# Altium schematic sheet SensorBoard.SchDoc
size A4
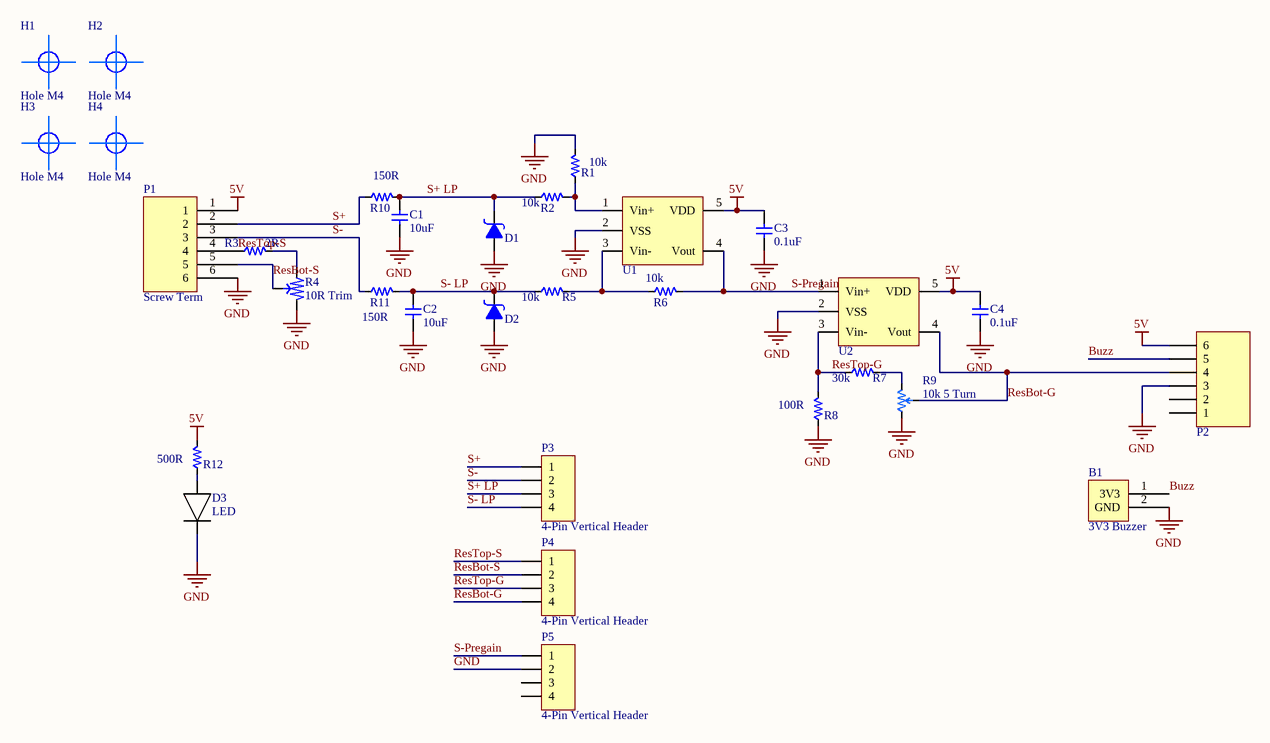
[diagram p0: SensorBoard.SchDoc]

## Parts
B1  3V3 Buzzer  [Buzzer_surfacemount]
C1  value 10uF  [PCB_GENERIC_SMD_0603]  (hidden comment: C060-0001U-00)
C2  value 10uF  [PCB_GENERIC_SMD_0603]  (hidden comment: C060-0001U-00)
C3  value 0.1uF  [PCB_GENERIC_SMD_0603]  (hidden comment: C060-0001U-00)
C4  value 0.1uF  [PCB_GENERIC_SMD_0603]  (hidden comment: C060-0001U-00)
D1  ONSEMI_MBRM110LT1G  [ON Semi Schottky Diode - MBRM110LT1G]  (value not drawn)
D2  ONSEMI_MBRM110LT1G  [ON Semi Schottky Diode - MBRM110LT1G]  (value not drawn)
D3  LED  [SMD_0603_LED]
H1  Hole M4  [M4_Hole]
H2  Hole M4  [M4_Hole]
H3  Hole M4  [M4_Hole]
H4  Hole M4  [M4_Hole]
P1  Screw Term  [6_Pin_ScrewTerm]
P2  SCH_MLX_MICROFIT_3X2  [PCB_MLX_MICROFIT_3X2]  (value not drawn)
P3  4-Pin Vertical Header  [4-Pin Vertical Header]
P4  4-Pin Vertical Header  [4-Pin Vertical Header]
P5  4-Pin Vertical Header  [4-Pin Vertical Header]
R1  Resistance: 10k  [PCB_GENERIC_SMD_0603]  (hidden comment: SCH_GENERIC_RESISTOR_0603)
R2  Resistance: 10k  [PCB_GENERIC_SMD_0603]  (hidden comment: SCH_GENERIC_RESISTOR_0603)
R3  Resistance: 2R  [PCB_GENERIC_SMD_0603]  (hidden comment: SCH_GENERIC_RESISTOR_0603)
R4  10R Trim  [10ohm1Turn_pot]
R5  Resistance: 10k  [PCB_GENERIC_SMD_0603]  (hidden comment: SCH_GENERIC_RESISTOR_0603)
R6  Resistance: 10k  [PCB_GENERIC_SMD_0603]  (hidden comment: SCH_GENERIC_RESISTOR_0603)
R7  Resistance: 30k  [PCB_GENERIC_SMD_0603]  (hidden comment: SCH_GENERIC_RESISTOR_0603)
R8  Resistance: 100R  [PCB_GENERIC_SMD_0603]  (hidden comment: SCH_GENERIC_RESISTOR_0603)
R9  10k 5 Turn  [10k5TurnPot]
R10  Resistance: 150R  [PCB_GENERIC_SMD_0603]  (hidden comment: SCH_GENERIC_RESISTOR_0603)
R11  Resistance: 150R  [PCB_GENERIC_SMD_0603]  (hidden comment: SCH_GENERIC_RESISTOR_0603)
R12  Resistance: 500R  [PCB_GENERIC_SMD_0603]  (hidden comment: SCH_GENERIC_RESISTOR_0603)
U1  MCP6001U  [MCP6001UT]  (value not drawn)
U2  MCP6001U  [MCP6001UT]  (value not drawn)

## Nets
5V: C3.2 C4.2 P1.1 P2.6 R12.2 U1.5(VDD) U2.5(VDD)
GND: B1.2(GND) C1.1 C2.1 C3.1 C4.1 D1.2 D2.2 D3.2 P1.6 P2.3 P5.2 R1.2 R4.1 R8.1 R9.3 U1.2(VSS) U2.2(VSS)
Buzz: B1.1(3V3) P2.5
ResBot-G: P2.4 P4.4 R9.2 U2.4(Vout)
ResBot-S: P1.5 P4.2 R4.2
ResTop-G: P4.3 R7.1 R8.2 U2.3(Vin-)
ResTop-S: P1.4 P4.1 R3.1
S+: P1.2 P3.1 R10.1
S+ LP: C1.2 D1.1 P3.3 R2.1 R10.2
S-: P1.3 P3.2 R11.1
S- LP: C2.2 D2.1 P3.4 R5.1 R11.2
S-Pregain: P5.1 R6.2 U1.4(Vout) U2.1(Vin+)
NetD3_1: D3.1 R12.1
NetR1_1: R1.1 R2.2 U1.1(Vin+)
NetR3_2: R3.2 R4.3
NetR5_2: R5.2 R6.1 U1.3(Vin-)
NetR7_2: R7.2 R9.1

Not connected (* = marked no-connect by the designer): P2 1 2; P5 3 4

## Library data of the parts
B1 = Buzzer_surfacemount: AUDIO PIEZO INDICATOR 2-5V TH; Supplier: Digikey; Supplier Part Number: 668-1204-ND
C1-C4 = C060-0001U-00: CAP CER 0603 1uF 16V X5R 20%; Tolerance: 20%; Voltage: 16V; Package: 0603
D1 D2 = ONSEMI_MBRM110LT1G: DIODE SCHOTTKY 10V 1A; Supplier 1: Digi-Key; Supplier Part Number 1: MBRM110LT1GOSDKR-ND
D3 = SMD_0603_LED
H1-H4 = Component_1
P1 = Component_1: CONN TERM BLOCK 6POS 5MM BLACK; Supplier: Digikey; Supplier Part Number: 1297-1112-2-ND
P3-P5 = 4-Pin Vertical Header: Manufacturer: Sullins; Manufacturer No.: PPPC041LFBN-RC
R1-R3 R5-R8 R10-R12 = SCH_GENERIC_RESISTOR_0603: Generic SMD resistor 0603
R4 = 10ohm1Turn_pot: TRIMMER 10 OHM 0.25W SMD; Supplier: Digikey; Supplier Part Number: 3314G-1-100ECT-ND
R9 = 10k 5 Turn: TRIMMER 10K OHM 0.25W SMD; Supplier: Digikey; Supplier Part Number: 3214X-1-103ECT-ND